# Altium schematic sheet Connecteurs.SchDoc
size A4; SheetNumber: 5; SheetTotal: 7
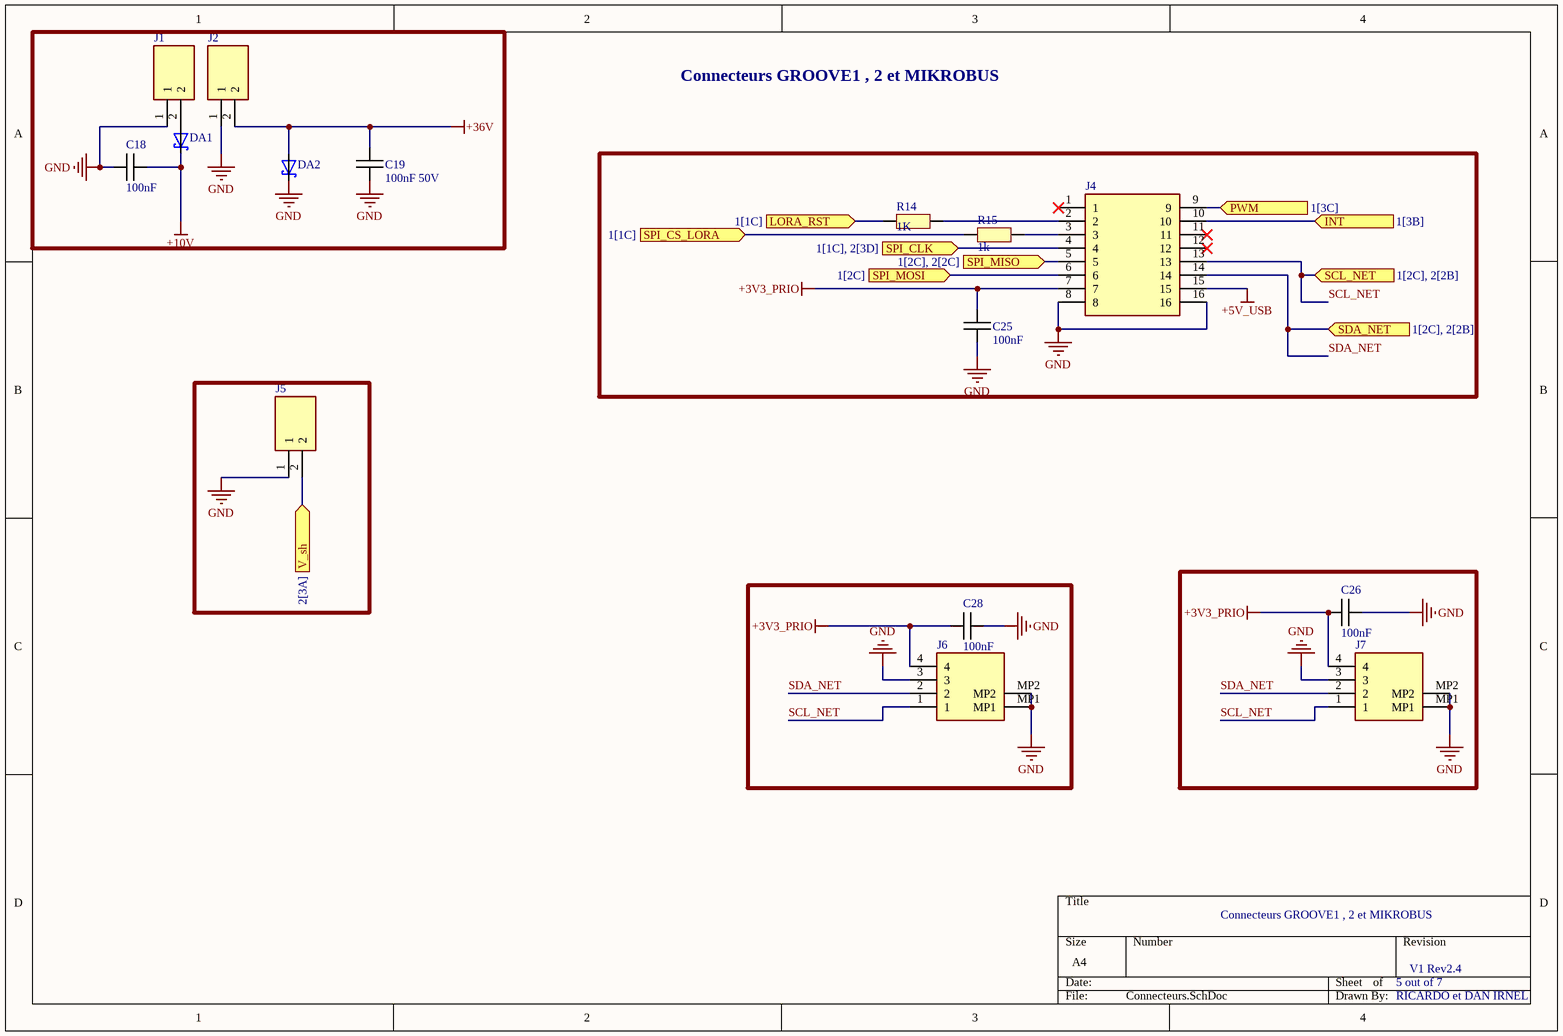
[diagram p0: Connecteurs.SchDoc]

## Parts
C18  100nF  [CAPC1005X06N]
C19  100nF 50V  [CAPC1005X06N]
C25  100nF  [CAPC1005X06N]
C26  100nF  [CAPC1005X06N]
C28  100nF  [CAPC1005X06N]
DA1  SD103AWS-7-F  [SD103AWS-7-F]  (value not drawn)
DA2  SD103AWS-7-F  [SD103AWS-7-F]  (value not drawn)
J1  61300211121  [61300211121]  (value not drawn)
J2  61300211121  [61300211121]  (value not drawn)
J4  825433-8  [Connect-Mikrobus]  (value not drawn)
J5  61300211121  [61300211121]  (value not drawn)
J6  114020164  [114020164]  (value not drawn)
J7  114020164  [114020164]  (value not drawn)
R14  1K  [RESC1005X06N]
R15  1k  [RESC1005X06N]

## Ports
INT (in, see 1[3B]), LORA_RST (in, see 1[1C]), PWM (in, see 1[3C]), SCL_NET (in, see 1[2C], 2[2B]), SDA_NET (in, see 1[2C], 2[2B]), SPI_CLK (in, see 1[1C], 2[3D]), SPI_CS_LORA (in, see 1[1C]), SPI_MISO (in, see 1[2C], 2[2C]), SPI_MOSI (in, see 1[2C]), V_sh (in, see 2[3A])

## Nets
+3V3_PRIO: C25.1 C26.2 C28.2 J4.7 J6.4 J7.4
+5V_USB: J4.15
+10V: C18.1 DA1.1(C)
+36V: C19.1 DA2.2(A) J2.2
GND: C18.2 C19.2 C25.2 C26.1 C28.1 DA2.1(C) J1.1 J2.1 J4.8 J4.16 J5.1 J6.3 J6.MP1 J6.MP2 J7.3 J7.MP1 J7.MP2
INT: J4.10 ; port INT
LORA_RST: R14.1 ; port LORA_RST
PWM: J4.9 ; port PWM
SCL_NET: J4.13 J6.1 J7.1 ; port SCL_NET
SDA_NET: J4.14 J6.2 J7.2 ; port SDA_NET
SPI_CLK: J4.4 ; port SPI_CLK
SPI_CS_LORA: R15.1 ; port SPI_CS_LORA
SPI_MISO: J4.5 ; port SPI_MISO
SPI_MOSI: J4.6 ; port SPI_MOSI
V_sh: J5.2 ; port V_sh
NetDA1_2: DA1.2(A) J1.2
NetJ4_2: J4.2 R14.2
NetJ4_3: J4.3 R15.2

Not connected (* = marked no-connect by the designer): J4 1* 11* 12*

## Notes on the sheet
- Connecteurs GROOVE1 , 2 et MIKROBUS
- 5 out of 7
- V1 Rev2.4
- RICARDO et DAN IRNEL

## Library data of the parts
C18 C19 C25 C26 C28 = Capacitor
DA1 DA2 = SD103AWS-7-F: Diode Array 3 Independent Schottky 40V 175mA Surface Mount 6-TSSOP, SC-88, SOT-363
J1 J2 J5 = 61300211121: WURTH ELEKTRONIK - 61300211121 - HEADER, 2.54MM, PIN, THT, VERTICAL, 2WAY
J4 = Connect-Mikrobus: Headers & Wire Housings 8P double for connection mikrobus; Manufacturer_Name: TE Connectivity; Manufacturer_Part_Number: 825433-8; Mouser Part Number: 571-825433-8
J6 J7 = 114020164: Seeed Studio Accessories Grove Female Header - SMD-4P-2.0mm-90D-20Pcs; Manufacturer_Name: Seeed Studio; Manufacturer_Part_Number: 114020164; Mouser Part Number: 713-114020164
R14 R15 = Resistor